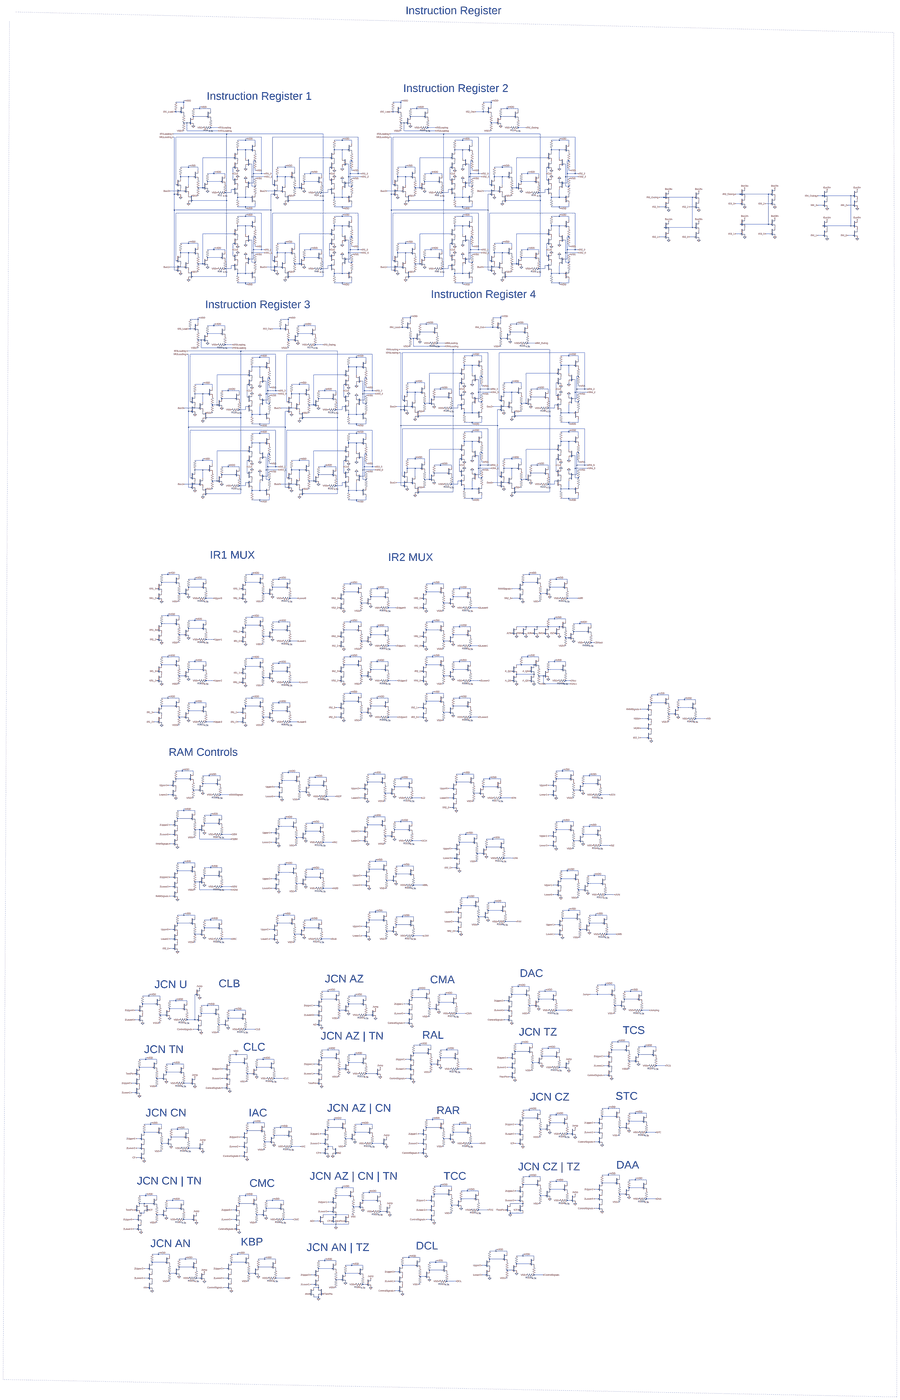
[diagram p0: schematic instruction_register.asc, whole sheet]
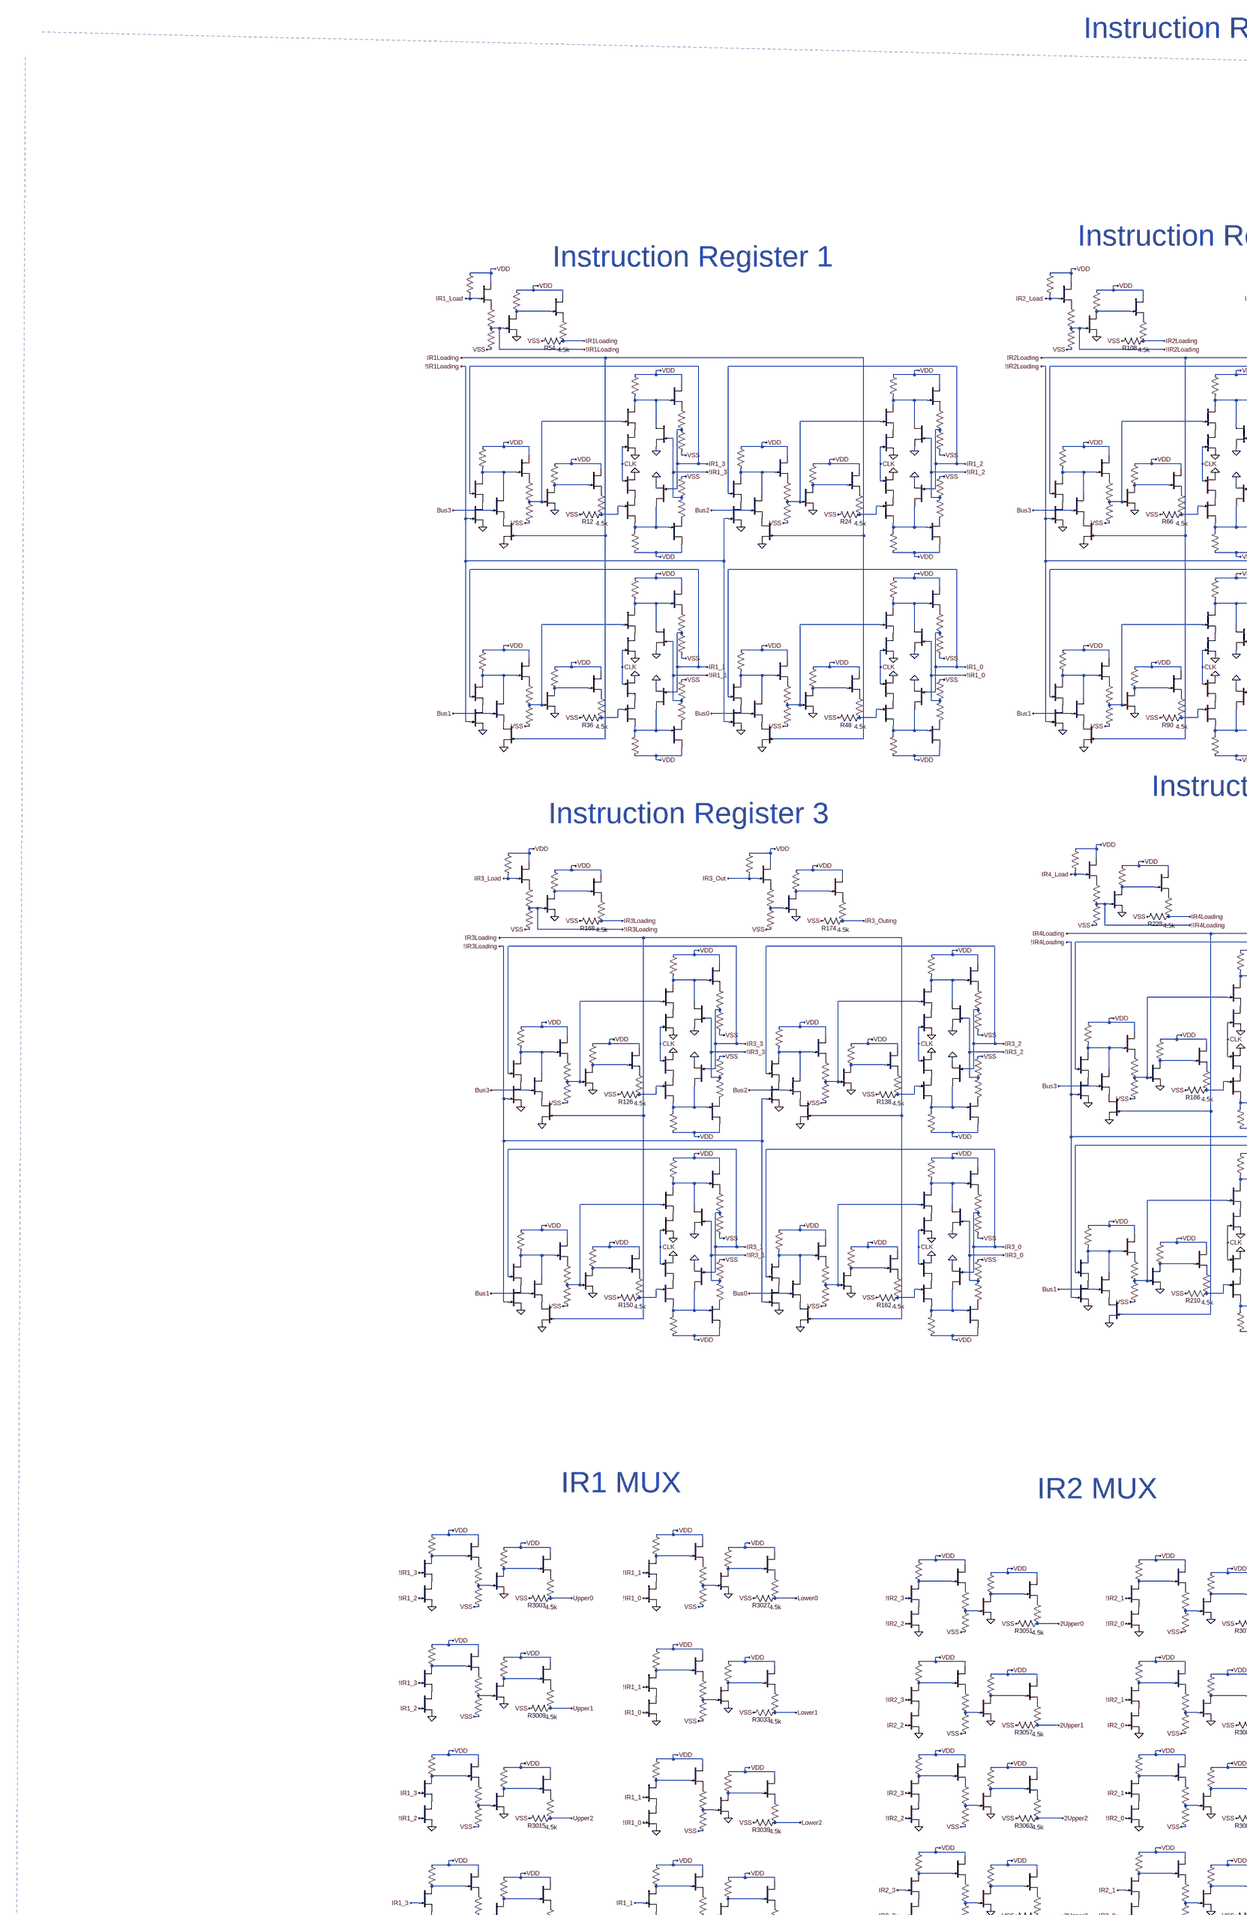
[diagram p1: schematic instruction_register.asc, part, row 1 of 2, column 1 of 2]
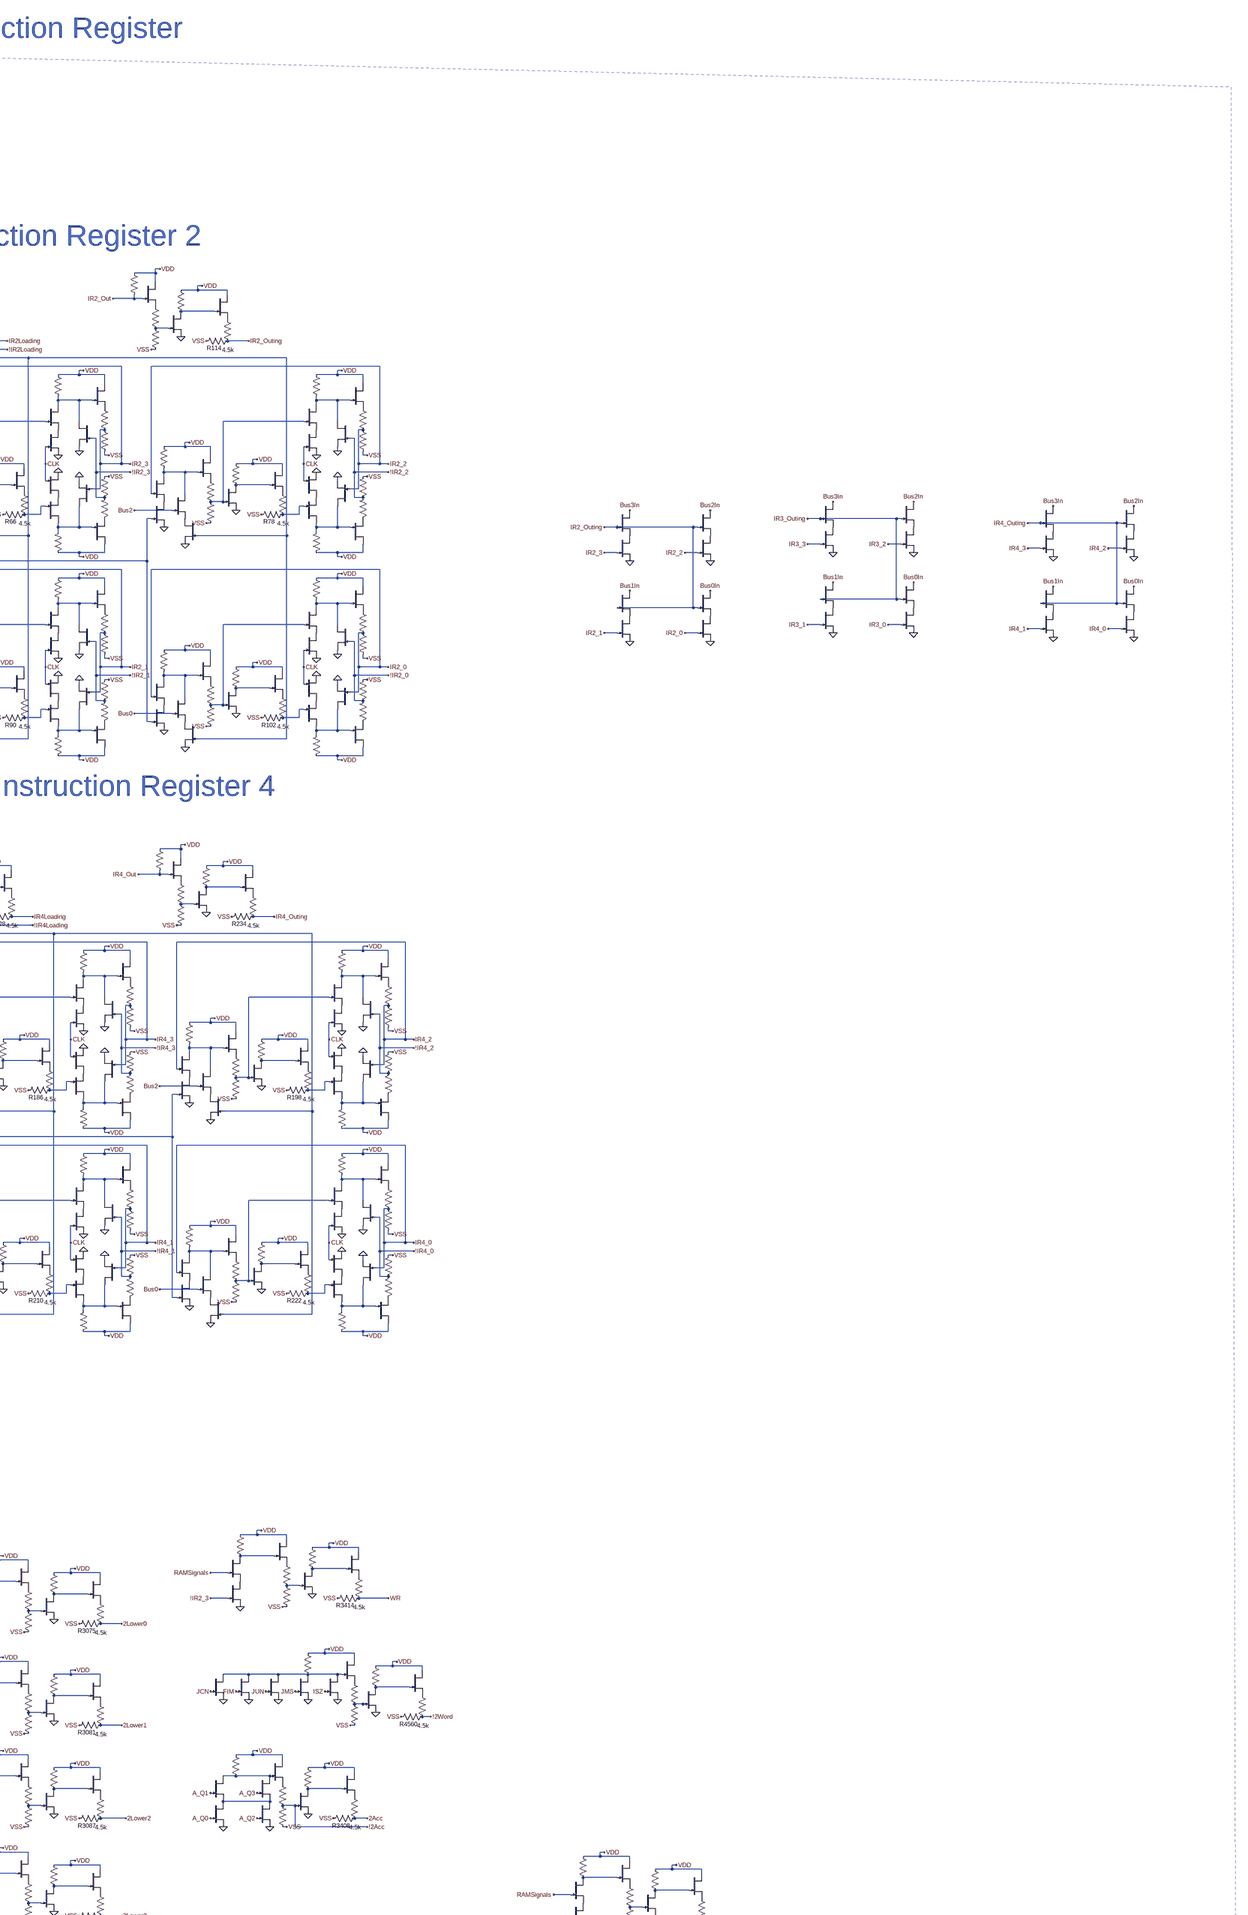
[diagram p2: schematic instruction_register.asc, part, row 1 of 2, column 2 of 2]
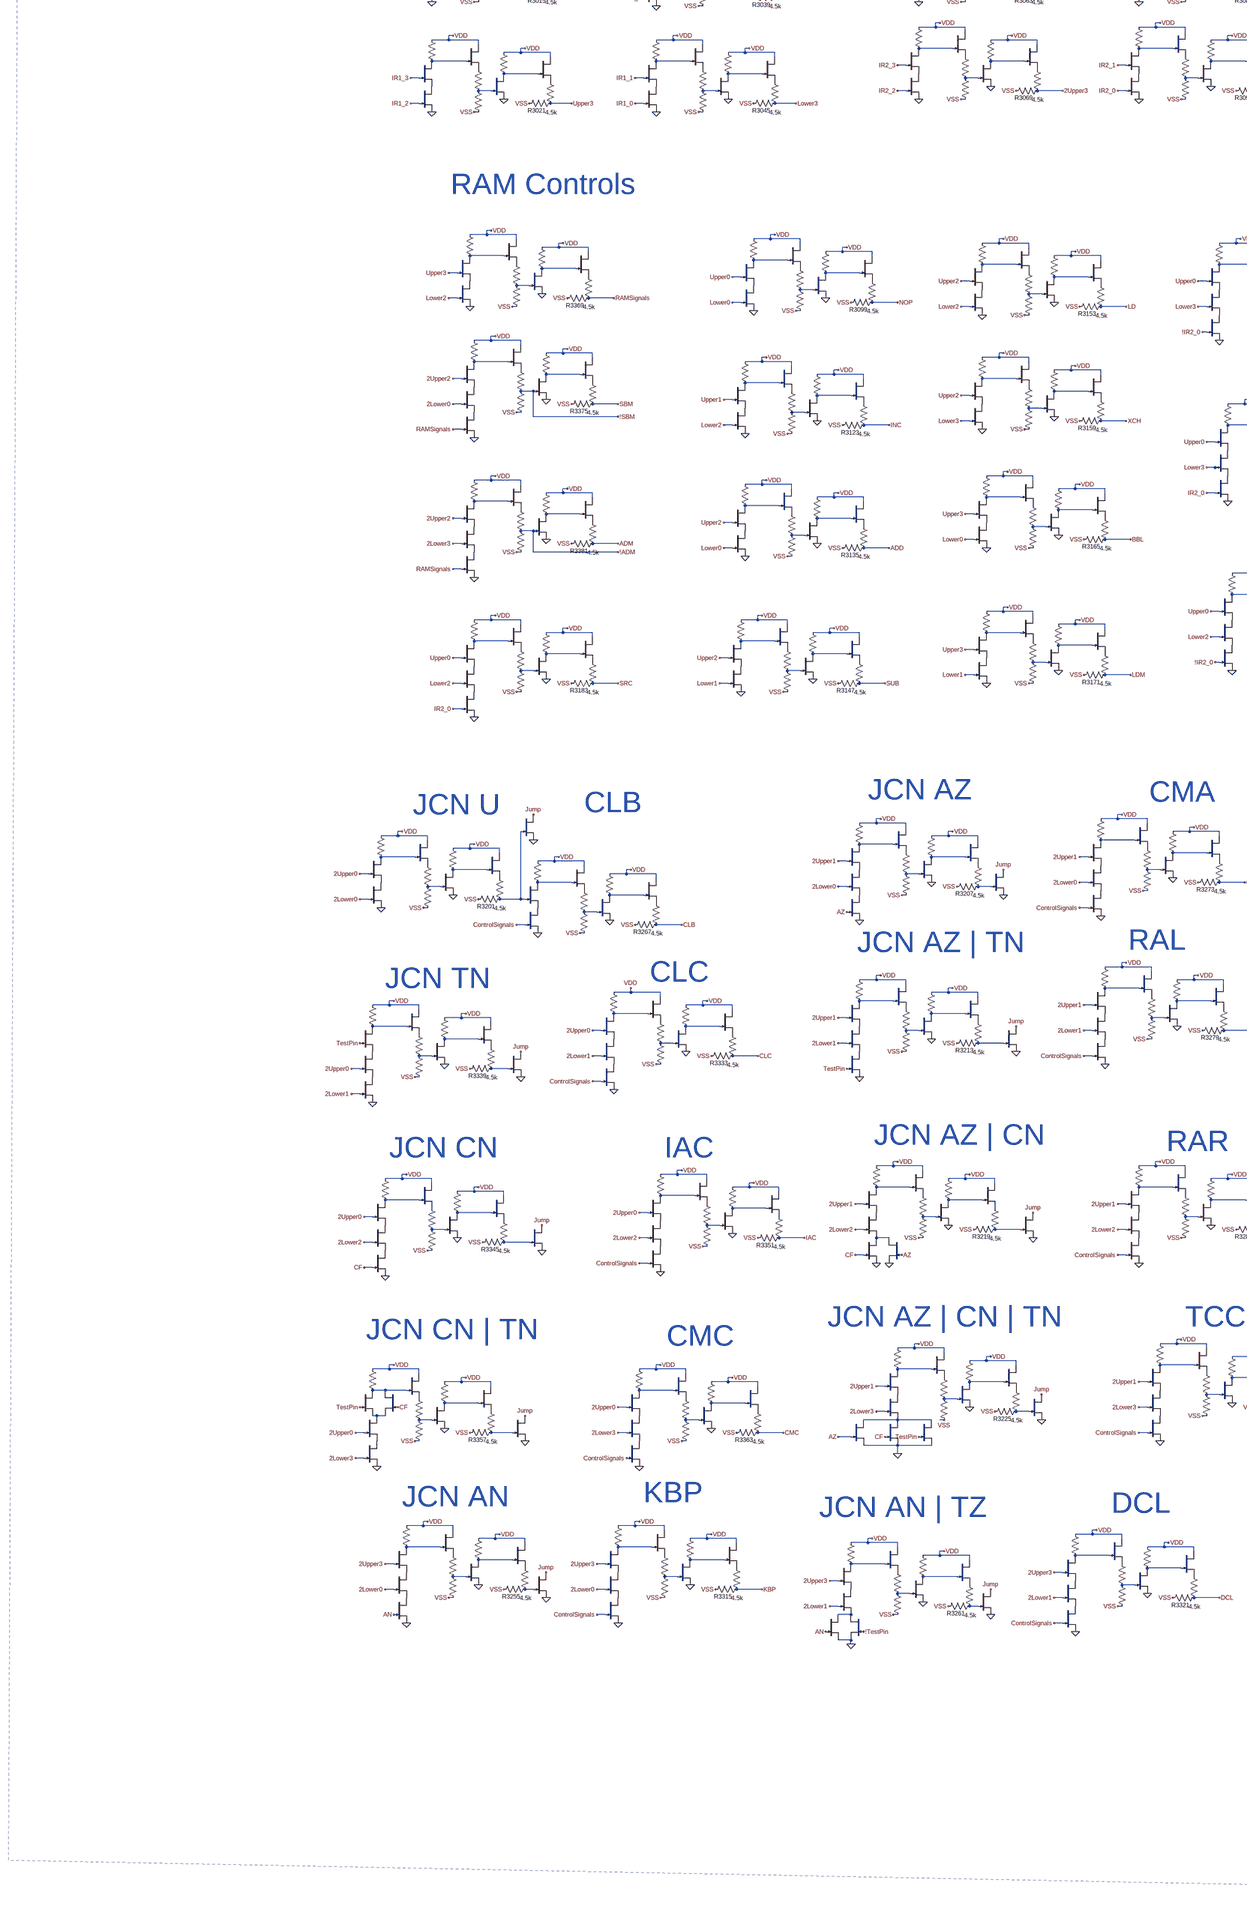
[diagram p3: schematic instruction_register.asc, part, row 2 of 2, column 1 of 2]
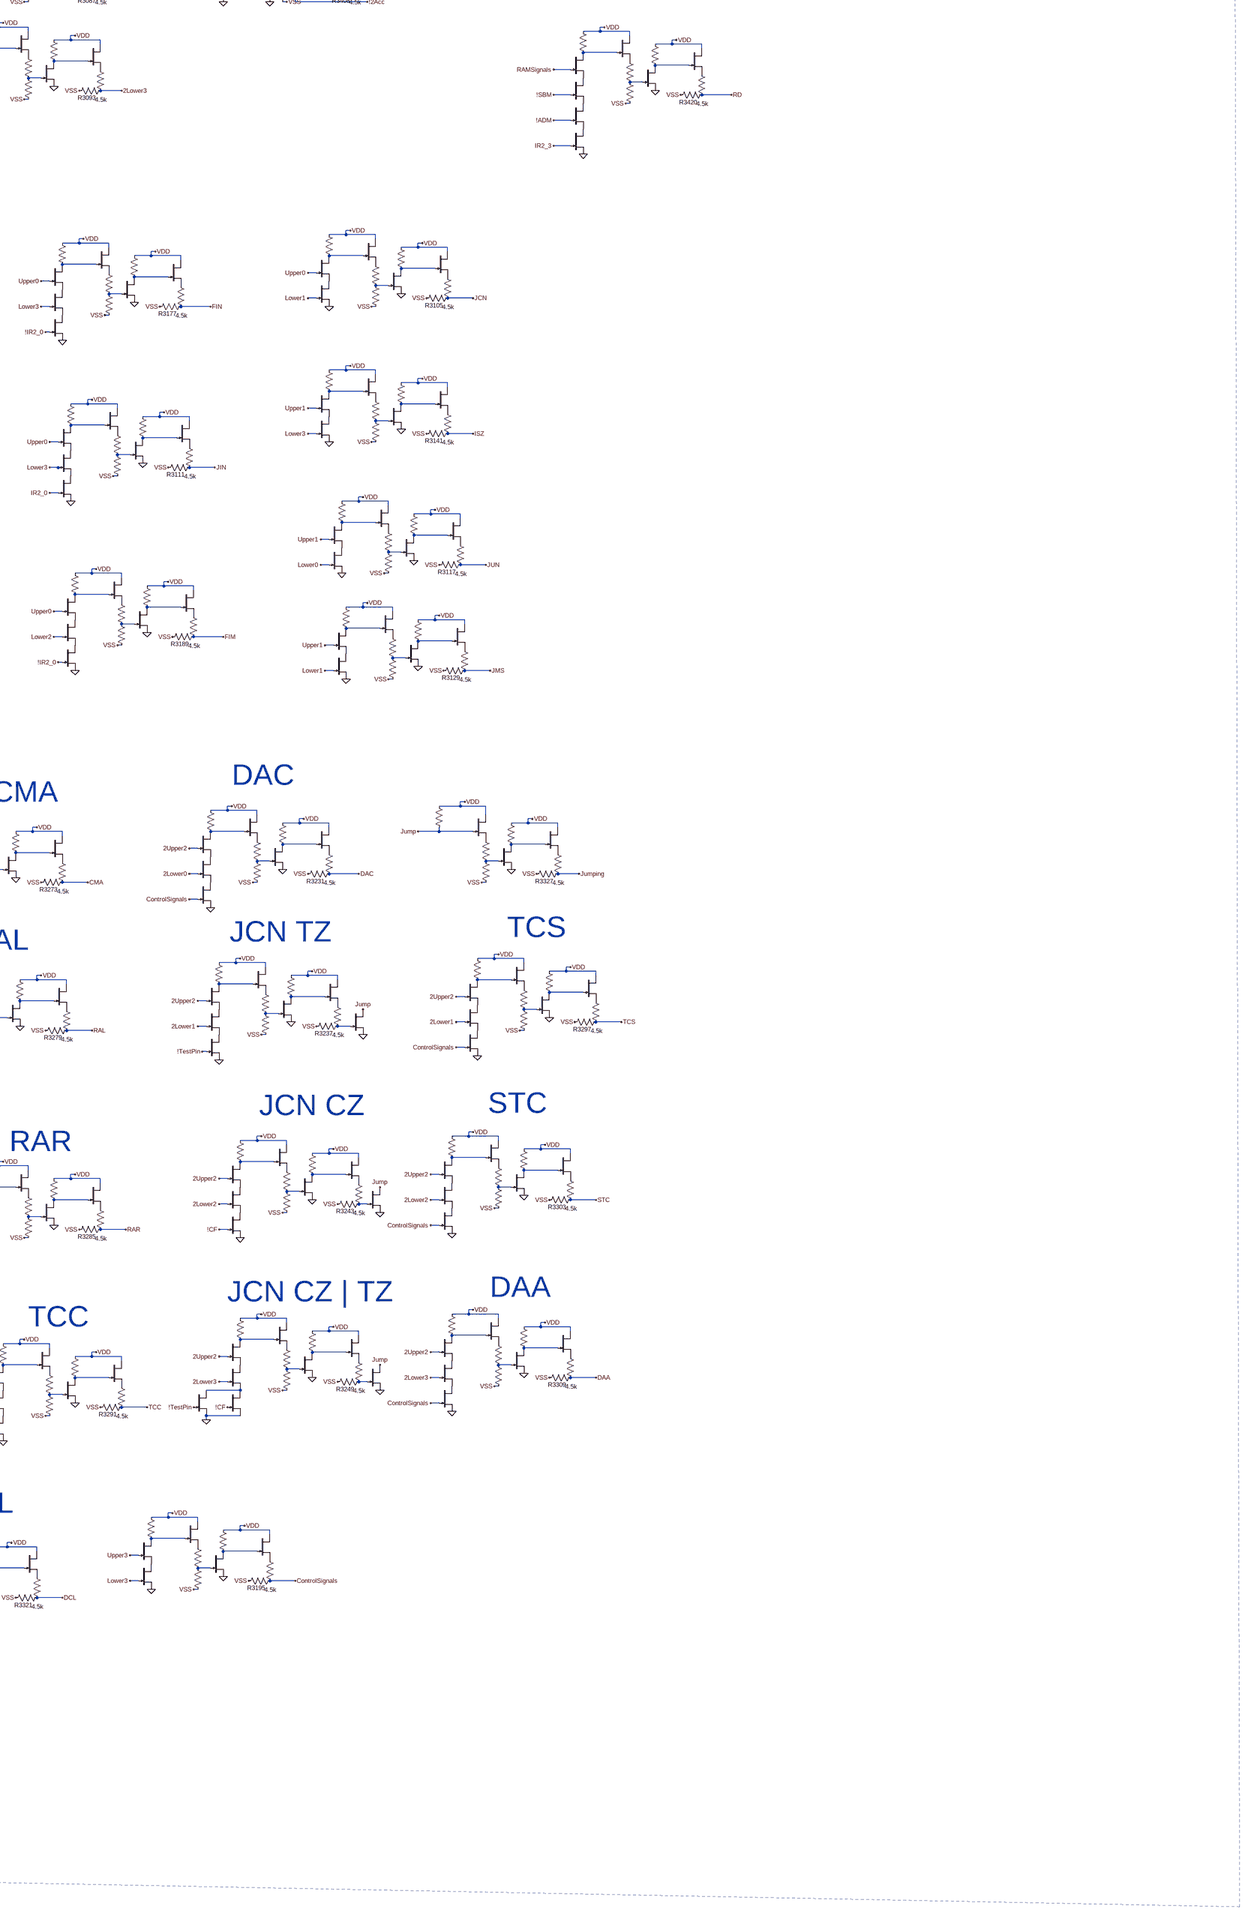
[diagram p4: schematic instruction_register.asc, part, row 2 of 2, column 2 of 2]
* instruction_register.asc
J_A1 P001 IR2_3 0 DR
J_A2 Bus3In IR2_Outing P001 DR
J_A3 P002 IR2_2 0 DR
J_A4 Bus2In IR2_Outing P002 DR
J_A5 P003 IR2_1 0 DR
J_A6 Bus1In IR2_Outing P003 DR
J_A7 P004 IR2_0 0 DR
J_A8 Bus0In IR2_Outing P004 DR
J_A9 P005 IR3_3 0 DR
J_A10 Bus3In IR3_Outing P005 DR
J_A11 P006 IR3_2 0 DR
J_A12 Bus2In IR3_Outing P006 DR
J_A13 P007 IR3_1 0 DR
J_A14 Bus1In IR3_Outing P007 DR
J_A15 P008 IR3_0 0 DR
J_A16 Bus0In IR3_Outing P008 DR
J_A17 P009 IR4_3 0 DR
J_A18 Bus3In IR4_Outing P009 DR
J_A19 P010 IR4_2 0 DR
J_A20 Bus2In IR4_Outing P010 DR
J_A21 P011 IR4_1 0 DR
J_A22 Bus1In IR4_Outing P011 DR
J_A23 P012 IR4_0 0 DR
J_A24 Bus0In IR4_Outing P012 DR
J_A25 N005 N009 P013 DR
R1 VDD N005 100k
J_F1 VDD N005 P014 DR
R2 P014 IR1_3 1k
R3 IR1_3 VSS 4.8k
J_B1 N005 !IR1_3 0 DR
J_A26 N025 N021 P015 DR
R4 VDD N025 100k
J_F2 VDD N025 P016 DR
R5 P016 !IR1_3 1k
R6 !IR1_3 VSS 4.8k
J_B2 N025 IR1_3 0 DR
J_A27 P013 CLK 0 DR
J_A28 P015 CLK 0 DR
J_A29 N013 IR1_3 P017 DR
R7 VDD N013 100k
J_F3 VDD N013 P018 DR
R8 P018 N009 1k
R9 N009 VSS 4.8k
J_B3 N013 Bus3 P019 DR
J_A30 N017 N009 0 DR
R10 VDD N017 50k
J_A31 VDD N017 P020 DR
R11 P020 N021 1k
R12 N021 VSS 4.5k
J_A32 P017 !IR1Loading 0 DR
J_B4 P019 IR1Loading 0 DR
J_A33 N006 N010 P021 DR
R13 VDD N006 100k
J_F4 VDD N006 P022 DR
R14 P022 IR1_2 1k
R15 IR1_2 VSS 4.8k
J_B5 N006 !IR1_2 0 DR
J_A34 N026 N022 P023 DR
R16 VDD N026 100k
J_F5 VDD N026 P024 DR
R17 P024 !IR1_2 1k
R18 !IR1_2 VSS 4.8k
J_B6 N026 IR1_2 0 DR
J_A35 P021 CLK 0 DR
J_A36 P023 CLK 0 DR
J_A37 N014 IR1_2 P025 DR
R19 VDD N014 100k
J_F6 VDD N014 P026 DR
R20 P026 N010 1k
R21 N010 VSS 4.8k
J_B7 N014 Bus2 P027 DR
J_A38 N018 N010 0 DR
R22 VDD N018 50k
J_A39 VDD N018 P028 DR
R23 P028 N022 1k
R24 N022 VSS 4.5k
J_A40 P025 !IR1Loading 0 DR
J_B8 P027 IR1Loading 0 DR
J_A41 N029 N033 P029 DR
R25 VDD N029 100k
J_F7 VDD N029 P030 DR
R26 P030 IR1_1 1k
R27 IR1_1 VSS 4.8k
J_B9 N029 !IR1_1 0 DR
J_A42 N049 N045 P031 DR
R28 VDD N049 100k
J_F8 VDD N049 P032 DR
R29 P032 !IR1_1 1k
R30 !IR1_1 VSS 4.8k
J_B10 N049 IR1_1 0 DR
J_A43 P029 CLK 0 DR
J_A44 P031 CLK 0 DR
J_A45 N037 IR1_1 P033 DR
R31 VDD N037 100k
J_F9 VDD N037 P034 DR
R32 P034 N033 1k
R33 N033 VSS 4.8k
J_B11 N037 Bus1 P035 DR
J_A46 N041 N033 0 DR
R34 VDD N041 50k
J_A47 VDD N041 P036 DR
R35 P036 N045 1k
R36 N045 VSS 4.5k
J_A48 P033 !IR1Loading 0 DR
J_B12 P035 IR1Loading 0 DR
J_A49 N030 N034 P037 DR
R37 VDD N030 100k
J_F10 VDD N030 P038 DR
R38 P038 IR1_0 1k
R39 IR1_0 VSS 4.8k
J_B13 N030 !IR1_0 0 DR
J_A50 N050 N046 P039 DR
R40 VDD N050 100k
J_F11 VDD N050 P040 DR
R41 P040 !IR1_0 1k
R42 !IR1_0 VSS 4.8k
J_B14 N050 IR1_0 0 DR
J_A51 P037 CLK 0 DR
J_A52 P039 CLK 0 DR
J_A53 N038 IR1_0 P041 DR
R43 VDD N038 100k
J_F12 VDD N038 P042 DR
R44 P042 N034 1k
R45 N034 VSS 4.8k
J_B15 N038 Bus0 P043 DR
J_A54 N042 N034 0 DR
R46 VDD N042 50k
J_A55 VDD N042 P044 DR
R47 P044 N046 1k
R48 N046 VSS 4.5k
J_A56 P041 !IR1Loading 0 DR
J_B16 P043 IR1Loading 0 DR
R49 VDD IR1_Load 100k
J_F13 VDD IR1_Load P045 DR
R50 P045 !IR1Loading 1k
R51 !IR1Loading VSS 4.8k
J_A57 N001 !IR1Loading 0 DR
R52 VDD N001 50k
J_A58 VDD N001 P046 DR
R53 P046 IR1Loading 1k
R54 IR1Loading VSS 4.5k
J_A59 N007 N011 P047 DR
R55 VDD N007 100k
J_F14 VDD N007 P048 DR
R56 P048 IR2_3 1k
R57 IR2_3 VSS 4.8k
J_B17 N007 !IR2_3 0 DR
J_A60 N027 N023 P049 DR
R58 VDD N027 100k
J_F15 VDD N027 P050 DR
R59 P050 !IR2_3 1k
R60 !IR2_3 VSS 4.8k
J_B18 N027 IR2_3 0 DR
J_A61 P047 CLK 0 DR
J_A62 P049 CLK 0 DR
J_A63 N015 IR2_3 P051 DR
R61 VDD N015 100k
J_F16 VDD N015 P052 DR
R62 P052 N011 1k
R63 N011 VSS 4.8k
J_B19 N015 Bus3 P053 DR
J_A64 N019 N011 0 DR
R64 VDD N019 50k
J_A65 VDD N019 P054 DR
R65 P054 N023 1k
R66 N023 VSS 4.5k
J_A66 P051 !IR2Loading 0 DR
J_B20 P053 IR2Loading 0 DR
J_A67 N008 N012 P055 DR
R67 VDD N008 100k
J_F17 VDD N008 P056 DR
R68 P056 IR2_2 1k
R69 IR2_2 VSS 4.8k
J_B21 N008 !IR2_2 0 DR
J_A68 N028 N024 P057 DR
R70 VDD N028 100k
J_F18 VDD N028 P058 DR
R71 P058 !IR2_2 1k
R72 !IR2_2 VSS 4.8k
J_B22 N028 IR2_2 0 DR
J_A69 P055 CLK 0 DR
J_A70 P057 CLK 0 DR
J_A71 N016 IR2_2 P059 DR
R73 VDD N016 100k
J_F19 VDD N016 P060 DR
R74 P060 N012 1k
R75 N012 VSS 4.8k
J_B23 N016 Bus2 P061 DR
J_A72 N020 N012 0 DR
R76 VDD N020 50k
J_A73 VDD N020 P062 DR
R77 P062 N024 1k
R78 N024 VSS 4.5k
J_A74 P059 !IR2Loading 0 DR
J_B24 P061 IR2Loading 0 DR
J_A75 N031 N035 P063 DR
R79 VDD N031 100k
J_F20 VDD N031 P064 DR
R80 P064 IR2_1 1k
R81 IR2_1 VSS 4.8k
J_B25 N031 !IR2_1 0 DR
J_A76 N051 N047 P065 DR
R82 VDD N051 100k
J_F21 VDD N051 P066 DR
R83 P066 !IR2_1 1k
R84 !IR2_1 VSS 4.8k
J_B26 N051 IR2_1 0 DR
J_A77 P063 CLK 0 DR
J_A78 P065 CLK 0 DR
J_A79 N039 IR2_1 P067 DR
R85 VDD N039 100k
J_F22 VDD N039 P068 DR
R86 P068 N035 1k
R87 N035 VSS 4.8k
J_B27 N039 Bus1 P069 DR
J_A80 N043 N035 0 DR
R88 VDD N043 50k
J_A81 VDD N043 P070 DR
R89 P070 N047 1k
R90 N047 VSS 4.5k
J_A82 P067 !IR2Loading 0 DR
J_B28 P069 IR2Loading 0 DR
J_A83 N032 N036 P071 DR
R91 VDD N032 100k
J_F23 VDD N032 P072 DR
R92 P072 IR2_0 1k
R93 IR2_0 VSS 4.8k
J_B29 N032 !IR2_0 0 DR
J_A84 N052 N048 P073 DR
R94 VDD N052 100k
J_F24 VDD N052 P074 DR
R95 P074 !IR2_0 1k
R96 !IR2_0 VSS 4.8k
J_B30 N052 IR2_0 0 DR
J_A85 P071 CLK 0 DR
J_A86 P073 CLK 0 DR
J_A87 N040 IR2_0 P075 DR
R97 VDD N040 100k
J_F25 VDD N040 P076 DR
R98 P076 N036 1k
R99 N036 VSS 4.8k
J_B31 N040 Bus0 P077 DR
J_A88 N044 N036 0 DR
R100 VDD N044 50k
J_A89 VDD N044 P078 DR
R101 P078 N048 1k
R102 N048 VSS 4.5k
J_A90 P075 !IR2Loading 0 DR
J_B32 P077 IR2Loading 0 DR
R103 VDD IR2_Load 100k
J_F26 VDD IR2_Load P079 DR
R104 P079 !IR2Loading 1k
R105 !IR2Loading VSS 4.8k
J_A91 N002 !IR2Loading 0 DR
R106 VDD N002 50k
J_A92 VDD N002 P080 DR
R107 P080 IR2Loading 1k
R108 IR2Loading VSS 4.5k
R109 VDD IR2_Out 100k
J_F27 VDD IR2_Out P081 DR
R110 P081 N004 1k
R111 N004 VSS 4.8k
J_A93 N003 N004 0 DR
R112 VDD N003 50k
J_A94 VDD N003 P082 DR
R113 P082 IR2_Outing 1k
R114 IR2_Outing VSS 4.5k
J_A95 N061 N065 P083 DR
R115 VDD N061 100k
J_F28 VDD N061 P084 DR
R116 P084 IR3_3 1k
R117 IR3_3 VSS 4.8k
J_B33 N061 !IR3_3 0 DR
J_A96 N081 N077 P085 DR
R118 VDD N081 100k
J_F29 VDD N081 P086 DR
R119 P086 !IR3_3 1k
R120 !IR3_3 VSS 4.8k
J_B34 N081 IR3_3 0 DR
J_A97 P083 CLK 0 DR
J_A98 P085 CLK 0 DR
J_A99 N069 IR3_3 P087 DR
R121 VDD N069 100k
J_F30 VDD N069 P088 DR
R122 P088 N065 1k
R123 N065 VSS 4.8k
J_B35 N069 Bus3 P089 DR
J_A100 N073 N065 0 DR
R124 VDD N073 50k
J_A101 VDD N073 P090 DR
R125 P090 N077 1k
R126 N077 VSS 4.5k
J_A102 P087 !IR3Loading 0 DR
J_B36 P089 IR3Loading 0 DR
J_A103 N062 N066 P091 DR
R127 VDD N062 100k
J_F31 VDD N062 P092 DR
R128 P092 IR3_2 1k
R129 IR3_2 VSS 4.8k
J_B37 N062 !IR3_2 0 DR
J_A104 N082 N078 P093 DR
R130 VDD N082 100k
J_F32 VDD N082 P094 DR
R131 P094 !IR3_2 1k
R132 !IR3_2 VSS 4.8k
J_B38 N082 IR3_2 0 DR
J_A105 P091 CLK 0 DR
J_A106 P093 CLK 0 DR
J_A107 N070 IR3_2 P095 DR
R133 VDD N070 100k
J_F33 VDD N070 P096 DR
R134 P096 N066 1k
R135 N066 VSS 4.8k
J_B39 N070 Bus2 P097 DR
J_A108 N074 N066 0 DR
R136 VDD N074 50k
J_A109 VDD N074 P098 DR
R137 P098 N078 1k
R138 N078 VSS 4.5k
J_A110 P095 !IR3Loading 0 DR
J_B40 P097 IR3Loading 0 DR
J_A111 N085 N089 P099 DR
R139 VDD N085 100k
J_F34 VDD N085 P100 DR
R140 P100 IR3_1 1k
R141 IR3_1 VSS 4.8k
J_B41 N085 !IR3_1 0 DR
J_A112 N105 N101 P101 DR
R142 VDD N105 100k
J_F35 VDD N105 P102 DR
R143 P102 !IR3_1 1k
R144 !IR3_1 VSS 4.8k
J_B42 N105 IR3_1 0 DR
J_A113 P099 CLK 0 DR
J_A114 P101 CLK 0 DR
J_A115 N093 IR3_1 P103 DR
R145 VDD N093 100k
J_F36 VDD N093 P104 DR
R146 P104 N089 1k
R147 N089 VSS 4.8k
J_B43 N093 Bus1 P105 DR
J_A116 N097 N089 0 DR
R148 VDD N097 50k
J_A117 VDD N097 P106 DR
R149 P106 N101 1k
R150 N101 VSS 4.5k
J_A118 P103 !IR3Loading 0 DR
J_B44 P105 IR3Loading 0 DR
J_A119 N086 N090 P107 DR
R151 VDD N086 100k
J_F37 VDD N086 P108 DR
R152 P108 IR3_0 1k
R153 IR3_0 VSS 4.8k
J_B45 N086 !IR3_0 0 DR
J_A120 N106 N102 P109 DR
R154 VDD N106 100k
J_F38 VDD N106 P110 DR
R155 P110 !IR3_0 1k
R156 !IR3_0 VSS 4.8k
J_B46 N106 IR3_0 0 DR
J_A121 P107 CLK 0 DR
J_A122 P109 CLK 0 DR
J_A123 N094 IR3_0 P111 DR
R157 VDD N094 100k
J_F39 VDD N094 P112 DR
R158 P112 N090 1k
R159 N090 VSS 4.8k
J_B47 N094 Bus0 P113 DR
J_A124 N098 N090 0 DR
R160 VDD N098 50k
J_A125 VDD N098 P114 DR
R161 P114 N102 1k
R162 N102 VSS 4.5k
J_A126 P111 !IR3Loading 0 DR
J_B48 P113 IR3Loading 0 DR
R163 VDD IR3_Load 100k
J_F40 VDD IR3_Load P115 DR
R164 P115 !IR3Loading 1k
R165 !IR3Loading VSS 4.8k
J_A127 N055 !IR3Loading 0 DR
R166 VDD N055 50k
J_A128 VDD N055 P116 DR
R167 P116 IR3Loading 1k
R168 IR3Loading VSS 4.5k
R169 VDD IR3_Out 100k
J_F41 VDD IR3_Out P117 DR
R170 P117 N058 1k
R171 N058 VSS 4.8k
J_A129 N056 N058 0 DR
R172 VDD N056 50k
J_A130 VDD N056 P118 DR
R173 P118 IR3_Outing 1k
R174 IR3_Outing VSS 4.5k
J_A131 N059 N063 P119 DR
R175 VDD N059 100k
J_F42 VDD N059 P120 DR
R176 P120 IR4_3 1k
R177 IR4_3 VSS 4.8k
J_B49 N059 !IR4_3 0 DR
J_A132 N079 N075 P121 DR
R178 VDD N079 100k
J_F43 VDD N079 P122 DR
R179 P122 !IR4_3 1k
R180 !IR4_3 VSS 4.8k
J_B50 N079 IR4_3 0 DR
J_A133 P119 CLK 0 DR
J_A134 P121 CLK 0 DR
J_A135 N067 IR4_3 P123 DR
R181 VDD N067 100k
J_F44 VDD N067 P124 DR
R182 P124 N063 1k
R183 N063 VSS 4.8k
J_B51 N067 Bus3 P125 DR
J_A136 N071 N063 0 DR
R184 VDD N071 50k
J_A137 VDD N071 P126 DR
R185 P126 N075 1k
R186 N075 VSS 4.5k
J_A138 P123 !IR4Loading 0 DR
J_B52 P125 IR4Loading 0 DR
J_A139 N060 N064 P127 DR
R187 VDD N060 100k
J_F45 VDD N060 P128 DR
R188 P128 IR4_2 1k
R189 IR4_2 VSS 4.8k
J_B53 N060 !IR4_2 0 DR
J_A140 N080 N076 P129 DR
R190 VDD N080 100k
J_F46 VDD N080 P130 DR
R191 P130 !IR4_2 1k
R192 !IR4_2 VSS 4.8k
J_B54 N080 IR4_2 0 DR
J_A141 P127 CLK 0 DR
J_A142 P129 CLK 0 DR
J_A143 N068 IR4_2 P131 DR
R193 VDD N068 100k
J_F47 VDD N068 P132 DR
R194 P132 N064 1k
R195 N064 VSS 4.8k
J_B55 N068 Bus2 P133 DR
J_A144 N072 N064 0 DR
R196 VDD N072 50k
J_A145 VDD N072 P134 DR
R197 P134 N076 1k
R198 N076 VSS 4.5k
J_A146 P131 !IR4Loading 0 DR
J_B56 P133 IR4Loading 0 DR
J_A147 N083 N087 P135 DR
R199 VDD N083 100k
J_F48 VDD N083 P136 DR
R200 P136 IR4_1 1k
R201 IR4_1 VSS 4.8k
J_B57 N083 !IR4_1 0 DR
J_A148 N103 N099 P137 DR
R202 VDD N103 100k
J_F49 VDD N103 P138 DR
R203 P138 !IR4_1 1k
R204 !IR4_1 VSS 4.8k
J_B58 N103 IR4_1 0 DR
J_A149 P135 CLK 0 DR
J_A150 P137 CLK 0 DR
J_A151 N091 IR4_1 P139 DR
R205 VDD N091 100k
J_F50 VDD N091 P140 DR
R206 P140 N087 1k
R207 N087 VSS 4.8k
J_B59 N091 Bus1 P141 DR
J_A152 N095 N087 0 DR
R208 VDD N095 50k
J_A153 VDD N095 P142 DR
R209 P142 N099 1k
R210 N099 VSS 4.5k
J_A154 P139 !IR4Loading 0 DR
J_B60 P141 IR4Loading 0 DR
J_A155 N084 N088 P143 DR
R211 VDD N084 100k
J_F51 VDD N084 P144 DR
R212 P144 IR4_0 1k
R213 IR4_0 VSS 4.8k
J_B61 N084 !IR4_0 0 DR
J_A156 N104 N100 P145 DR
R214 VDD N104 100k
J_F52 VDD N104 P146 DR
R215 P146 !IR4_0 1k
R216 !IR4_0 VSS 4.8k
J_B62 N104 IR4_0 0 DR
J_A157 P143 CLK 0 DR
J_A158 P145 CLK 0 DR
J_A159 N092 IR4_0 P147 DR
R217 VDD N092 100k
J_F53 VDD N092 P148 DR
R218 P148 N088 1k
R219 N088 VSS 4.8k
J_B63 N092 Bus0 P149 DR
J_A160 N096 N088 0 DR
R220 VDD N096 50k
J_A161 VDD N096 P150 DR
R221 P150 N100 1k
R222 N100 VSS 4.5k
J_A162 P147 !IR4Loading 0 DR
J_B64 P149 IR4Loading 0 DR
R223 VDD IR4_Load 100k
J_F54 VDD IR4_Load P151 DR
R224 P151 !IR4Loading 1k
R225 !IR4Loading VSS 4.8k
J_A163 N053 !IR4Loading 0 DR
R226 VDD N053 50k
J_A164 VDD N053 P152 DR
R227 P152 IR4Loading 1k
R228 IR4Loading VSS 4.5k
R229 VDD IR4_Out 100k
J_F55 VDD IR4_Out P153 DR
R230 P153 N057 1k
R231 N057 VSS 4.8k
J_A165 N054 N057 0 DR
R232 VDD N054 50k
J_A166 VDD N054 P154 DR
R233 P154 IR4_Outing 1k
R234 IR4_Outing VSS 4.5k
J_A1920 N107 !IR1_3 P155 DR
R2998 VDD N107 100k
J_F734 VDD N107 P156 DR
R2999 P156 N115 1k
R3000 N115 VSS 4.8k
J_B906 P155 !IR1_2 0 DR
J_A1921 N110 N115 0 DR
R3001 VDD N110 50k
J_F735 VDD N110 P157 DR
R3002 P157 Upper0 1k
R3003 Upper0 VSS 4.5k
J_A1922 N122 !IR1_3 P158 DR
R3004 VDD N122 100k
J_F736 VDD N122 P159 DR
R3005 P159 N130 1k
R3006 N130 VSS 4.8k
J_B907 P158 IR1_2 0 DR
J_A1923 N125 N130 0 DR
R3007 VDD N125 50k
J_F737 VDD N125 P160 DR
R3008 P160 Upper1 1k
R3009 Upper1 VSS 4.5k
J_A1924 N137 IR1_3 P161 DR
R3010 VDD N137 100k
J_F738 VDD N137 P162 DR
R3011 P162 N148 1k
R3012 N148 VSS 4.8k
J_B908 P161 !IR1_2 0 DR
J_A1925 N142 N148 0 DR
R3013 VDD N142 50k
J_F739 VDD N142 P163 DR
R3014 P163 Upper2 1k
R3015 Upper2 VSS 4.5k
J_A1926 N155 IR1_3 P164 DR
R3016 VDD N155 100k
J_F740 VDD N155 P165 DR
R3017 P165 N165 1k
R3018 N165 VSS 4.8k
J_B909 P164 IR1_2 0 DR
J_A1927 N160 N165 0 DR
R3019 VDD N160 50k
J_F741 VDD N160 P166 DR
R3020 P166 Upper3 1k
R3021 Upper3 VSS 4.5k
J_A1928 N108 !IR1_1 P167 DR
R3022 VDD N108 100k
J_F742 VDD N108 P168 DR
R3023 P168 N116 1k
R3024 N116 VSS 4.8k
J_B910 P167 !IR1_0 0 DR
J_A1929 N111 N116 0 DR
R3025 VDD N111 50k
J_F743 VDD N111 P169 DR
R3026 P169 Lower0 1k
R3027 Lower0 VSS 4.5k
J_A1930 N123 !IR1_1 P170 DR
R3028 VDD N123 100k
J_F744 VDD N123 P171 DR
R3029 P171 N133 1k
R3030 N133 VSS 4.8k
J_B911 P170 IR1_0 0 DR
J_A1931 N126 N133 0 DR
R3031 VDD N126 50k
J_F745 VDD N126 P172 DR
R3032 P172 Lower1 1k
R3033 Lower1 VSS 4.5k
J_A1932 N141 IR1_1 P173 DR
R3034 VDD N141 100k
J_F746 VDD N141 P174 DR
R3035 P174 N151 1k
R3036 N151 VSS 4.8k
J_B912 P173 !IR1_0 0 DR
J_A1933 N146 N151 0 DR
R3037 VDD N146 50k
J_F747 VDD N146 P175 DR
R3038 P175 Lower2 1k
R3039 Lower2 VSS 4.5k
J_A1934 N156 IR1_1 P176 DR
R3040 VDD N156 100k
J_F748 VDD N156 P177 DR
R3041 P177 N166 1k
R3042 N166 VSS 4.8k
J_B913 P176 IR1_0 0 DR
J_A1935 N161 N166 0 DR
R3043 VDD N161 50k
J_F749 VDD N161 P178 DR
R3044 P178 Lower3 1k
R3045 Lower3 VSS 4.5k
J_A1936 N113 !IR2_3 P179 DR
R3046 VDD N113 100k
J_F750 VDD N113 P180 DR
R3047 P180 N120 1k
R3048 N120 VSS 4.8k
J_B914 P179 !IR2_2 0 DR
J_A1937 N118 N120 0 DR
R3049 VDD N118 50k
J_F751 VDD N118 P181 DR
R3050 P181 2Upper0 1k
R3051 2Upper0 VSS 4.5k
J_A1938 N127 !IR2_3 P182 DR
R3052 VDD N127 100k
J_F752 VDD N127 P183 DR
R3053 P183 N135 1k
R3054 N135 VSS 4.8k
J_B915 P182 IR2_2 0 DR
J_A1939 N131 N135 0 DR
R3055 VDD N131 50k
J_F753 VDD N131 P184 DR
R3056 P184 2Upper1 1k
R3057 2Upper1 VSS 4.5k
J_A1940 N138 IR2_3 P185 DR
R3058 VDD N138 100k
J_F754 VDD N138 P186 DR
R3059 P186 N149 1k
R3060 N149 VSS 4.8k
J_B916 P185 !IR2_2 0 DR
J_A1941 N143 N149 0 DR
R3061 VDD N143 50k
J_F755 VDD N143 P187 DR
R3062 P187 2Upper2 1k
R3063 2Upper2 VSS 4.5k
J_A1942 N152 IR2_3 P188 DR
R3064 VDD N152 100k
J_F756 VDD N152 P189 DR
R3065 P189 N162 1k
R3066 N162 VSS 4.8k
J_B917 P188 IR2_2 0 DR
J_A1943 N157 N162 0 DR
R3067 VDD N157 50k
J_F757 VDD N157 P190 DR
R3068 P190 2Upper3 1k
R3069 2Upper3 VSS 4.5k
J_A1944 N114 !IR2_1 P191 DR
R3070 VDD N114 100k
J_F758 VDD N114 P192 DR
R3071 P192 N121 1k
R3072 N121 VSS 4.8k
J_B918 P191 !IR2_0 0 DR
J_A1945 N119 N121 0 DR
R3073 VDD N119 50k
J_F759 VDD N119 P193 DR
R3074 P193 2Lower0 1k
R3075 2Lower0 VSS 4.5k
J_A1946 N128 !IR2_1 P194 DR
R3076 VDD N128 100k
J_F760 VDD N128 P195 DR
R3077 P195 N136 1k
R3078 N136 VSS 4.8k
J_B919 P194 IR2_0 0 DR
J_A1947 N132 N136 0 DR
R3079 VDD N132 50k
J_F761 VDD N132 P196 DR
R3080 P196 2Lower1 1k
R3081 2Lower1 VSS 4.5k
J_A1948 N139 IR2_1 P197 DR
R3082 VDD N139 100k
J_F762 VDD N139 P198 DR
R3083 P198 N150 1k
R3084 N150 VSS 4.8k
J_B920 P197 !IR2_0 0 DR
J_A1949 N144 N150 0 DR
R3085 VDD N144 50k
J_F763 VDD N144 P199 DR
R3086 P199 2Lower2 1k
R3087 2Lower2 VSS 4.5k
J_A1950 N153 IR2_1 P200 DR
R3088 VDD N153 100k
J_F764 VDD N153 P201 DR
R3089 P201 N163 1k
R3090 N163 VSS 4.8k
J_B921 P200 IR2_0 0 DR
J_A1951 N158 N163 0 DR
R3091 VDD N158 50k
J_F765 VDD N158 P202 DR
R3092 P202 2Lower3 1k
R3093 2Lower3 VSS 4.5k
J_A1952 N169 Upper0 P203 DR
R3094 VDD N169 100k
J_F766 VDD N169 P204 DR
R3095 P204 N179 1k
R3096 N179 VSS 4.8k
J_B922 P203 Lower0 0 DR
J_A1953 N174 N179 0 DR
R3097 VDD N174 50k
J_F767 VDD N174 P205 DR
R3098 P205 NOP 1k
R3099 NOP VSS 4.5k
J_A1954 N168 Upper0 P206 DR
R3100 VDD N168 100k
J_F768 VDD N168 P207 DR
R3101 P207 N178 1k
R3102 N178 VSS 4.8k
J_B923 P206 Lower1 0 DR
J_A1955 N173 N178 0 DR
R3103 VDD N173 50k
J_F769 VDD N173 P208 DR
R3104 P208 JCN 1k
R3105 JCN VSS 4.5k
J_A1956 N193 Upper0 P209 DR
R3106 VDD N193 100k
J_F770 VDD N193 P210 DR
R3107 P210 N195 1k
R3108 N195 VSS 4.8k
J_B924 P209 Lower3 P211 DR
J_A1957 N194 N195 0 DR
R3109 VDD N194 50k
J_F771 VDD N194 P212 DR
R3110 P212 JIN 1k
R3111 JIN VSS 4.5k
J_A1958 N202 Upper1 P213 DR
R3112 VDD N202 100k
J_F772 VDD N202 P214 DR
R3113 P214 N206 1k
R3114 N206 VSS 4.8k
J_B925 P213 Lower0 0 DR
J_A1959 N205 N206 0 DR
R3115 VDD N205 50k
J_F773 VDD N205 P215 DR
R3116 P215 JUN 1k
R3117 JUN VSS 4.5k
J_A1960 N185 Upper1 P216 DR
R3118 VDD N185 100k
J_F774 VDD N185 P217 DR
R3119 P217 N191 1k
R3120 N191 VSS 4.8k
J_B926 P216 Lower2 0 DR
J_A1961 N188 N191 0 DR
R3121 VDD N188 50k
J_F775 VDD N188 P218 DR
R3122 P218 INC 1k
R3123 INC VSS 4.5k
J_A1962 N210 Upper1 P219 DR
R3124 VDD N210 100k
J_F776 VDD N210 P220 DR
R3125 P220 N218 1k
R3126 N218 VSS 4.8k
J_B927 P219 Lower1 0 DR
J_A1963 N214 N218 0 DR
R3127 VDD N214 50k
J_F777 VDD N214 P221 DR
R3128 P221 JMS 1k
R3129 JMS VSS 4.5k
J_A1964 N198 Upper2 P222 DR
R3130 VDD N198 100k
J_F778 VDD N198 P223 DR
R3131 P223 N204 1k
R3132 N204 VSS 4.8k
J_B928 P222 Lower0 0 DR
J_A1965 N201 N204 0 DR
R3133 VDD N201 50k
J_F779 VDD N201 P224 DR
R3134 P224 ADD 1k
R3135 ADD VSS 4.5k
J_A1966 N187 Upper1 P225 DR
R3136 VDD N187 100k
J_F780 VDD N187 P226 DR
R3137 P226 N192 1k
R3138 N192 VSS 4.8k
J_B929 P225 Lower3 0 DR
J_A1967 N189 N192 0 DR
R3139 VDD N189 50k
J_F781 VDD N189 P227 DR
R3140 P227 ISZ 1k
R3141 ISZ VSS 4.5k
J_A1968 N213 Upper2 P228 DR
R3142 VDD N213 100k
J_F782 VDD N213 P229 DR
R3143 P229 N221 1k
R3144 N221 VSS 4.8k
J_B930 P228 Lower1 0 DR
J_A1969 N217 N221 0 DR
R3145 VDD N217 50k
J_F783 VDD N217 P230 DR
R3146 P230 SUB 1k
R3147 SUB VSS 4.5k
J_A1970 N170 Upper2 P231 DR
R3148 VDD N170 100k
J_F784 VDD N170 P232 DR
R3149 P232 N180 1k
R3150 N180 VSS 4.8k
J_B931 P231 Lower2 0 DR
J_A1971 N175 N180 0 DR
R3151 VDD N175 50k
J_F785 VDD N175 P233 DR
R3152 P233 LD 1k
R3153 LD VSS 4.5k
J_A1972 N184 Upper2 P234 DR
R3154 VDD N184 100k
J_F786 VDD N184 P235 DR
R3155 P235 N190 1k
R3156 N190 VSS 4.8k
J_B932 P234 Lower3 0 DR
J_A1973 N186 N190 0 DR
R3157 VDD N186 50k
J_F787 VDD N186 P236 DR
R3158 P236 XCH 1k
R3159 XCH VSS 4.5k
J_A1974 N196 Upper3 P237 DR
R3160 VDD N196 100k
J_F788 VDD N196 P238 DR
R3161 P238 N203 1k
R3162 N203 VSS 4.8k
J_B933 P237 Lower0 0 DR
J_A1975 N199 N203 0 DR
R3163 VDD N199 50k
J_F789 VDD N199 P239 DR
R3164 P239 BBL 1k
R3165 BBL VSS 4.5k
J_A1976 N211 Upper3 P240 DR
R3166 VDD N211 100k
J_F790 VDD N211 P241 DR
R3167 P241 N219 1k
R3168 N219 VSS 4.8k
J_B934 P240 Lower1 0 DR
J_A1977 N215 N219 0 DR
R3169 VDD N215 50k
J_F791 VDD N215 P242 DR
R3170 P242 LDM 1k
R3171 LDM VSS 4.5k
J_B935 P211 IR2_0 0 DR
J_A1978 N171 Upper0 P243 DR
R3172 VDD N171 100k
J_F792 VDD N171 P244 DR
R3173 P244 N181 1k
R3174 N181 VSS 4.8k
J_B936 P243 Lower3 P245 DR
J_A1979 N176 N181 0 DR
R3175 VDD N176 50k
J_F793 VDD N176 P246 DR
R3176 P246 FIN 1k
R3177 FIN VSS 4.5k
J_B937 P245 !IR2_0 0 DR
J_A1980 N212 Upper0 P247 DR
R3178 VDD N212 100k
J_F794 VDD N212 P248 DR
R3179 P248 N220 1k
R3180 N220 VSS 4.8k
J_B938 P247 Lower2 P249 DR
J_A1981 N216 N220 0 DR
R3181 VDD N216 50k
J_F795 VDD N216 P250 DR
R3182 P250 SRC 1k
R3183 SRC VSS 4.5k
J_B939 P249 IR2_0 0 DR
J_A1982 N207 Upper0 P251 DR
R3184 VDD N207 100k
J_F796 VDD N207 P252 DR
R3185 P252 N209 1k
R3186 N209 VSS 4.8k
J_B940 P251 Lower2 P253 DR
J_A1983 N208 N209 0 DR
R3187 VDD N208 50k
J_F797 VDD N208 P254 DR
R3188 P254 FIM 1k
R3189 FIM VSS 4.5k
J_B941 P253 !IR2_0 0 DR
J_A1984 N308 Upper3 P255 DR
R3190 VDD N308 100k
J_F798 VDD N308 P256 DR
R3191 P256 N317 1k
R3192 N317 VSS 4.8k
J_B942 P255 Lower3 0 DR
J_A1985 N311 N317 0 DR
R3193 VDD N311 50k
J_F799 VDD N311 P257 DR
R3194 P257 ControlSignals 1k
R3195 ControlSignals VSS 4.5k
J_A1986 N228 2Upper0 P258 DR
R3196 VDD N228 100k
J_F800 VDD N228 P259 DR
R3197 P259 N236 1k
R3198 N236 VSS 4.8k
J_B943 P258 2Lower0 0 DR
J_A1987 N232 N236 0 DR
R3199 VDD N232 50k
J_F801 VDD N232 P260 DR
R3200 P260 N239 1k
R3201 N239 VSS 4.5k
J_A1988 N224 2Upper1 P261 DR
R3202 VDD N224 100k
J_F802 VDD N224 P262 DR
R3203 P262 N234 1k
R3204 N234 VSS 4.8k
J_B944 P261 2Lower0 P263 DR
J_A1989 N229 N234 0 DR
R3205 VDD N229 50k
J_F803 VDD N229 P264 DR
R3206 P264 N237 1k
R3207 N237 VSS 4.5k
J_A1990 N246 2Upper1 P265 DR
R3208 VDD N246 100k
J_F804 VDD N246 P266 DR
R3209 P266 N256 1k
R3210 N256 VSS 4.8k
J_B945 P265 2Lower1 P267 DR
J_A1991 N250 N256 0 DR
R3211 VDD N250 50k
J_F805 VDD N250 P268 DR
R3212 P268 N259 1k
R3213 N259 VSS 4.5k
J_A1992 N266 2Upper1 P269 DR
R3214 VDD N266 100k
J_F806 VDD N266 P270 DR
R3215 P270 N277 1k
R3216 N277 VSS 4.8k
J_B946 P269 2Lower2 N282 DR
J_A1993 N272 N277 0 DR
R3217 VDD N272 50k
J_F807 VDD N272 P271 DR
R3218 P271 N281 1k
R3219 N281 VSS 4.5k
J_A1994 N290 2Upper1 P272 DR
R3220 VDD N290 100k
J_F808 VDD N290 P273 DR
R3221 P273 N299 1k
R3222 N299 VSS 4.8k
J_B947 P272 2Lower3 N306 DR
J_A1995 N293 N299 0 DR
R3223 VDD N293 50k
J_F809 VDD N293 P274 DR
R3224 P274 N302 1k
R3225 N302 VSS 4.5k
J_A1996 N222 2Upper2 P275 DR
R3226 VDD N222 100k
J_F810 VDD N222 P276 DR
R3227 P276 N230 1k
R3228 N230 VSS 4.8k
J_B948 P275 2Lower0 P277 DR
J_A1997 N225 N230 0 DR
R3229 VDD N225 50k
J_F811 VDD N225 P278 DR
R3230 P278 DAC 1k
R3231 DAC VSS 4.5k
J_A1998 N242 2Upper2 P279 DR
R3232 VDD N242 100k
J_F812 VDD N242 P280 DR
R3233 P280 N251 1k
R3234 N251 VSS 4.8k
J_B949 P279 2Lower1 P281 DR
J_A1999 N245 N251 0 DR
R3235 VDD N245 50k
J_F813 VDD N245 P282 DR
R3236 P282 N255 1k
R3237 N255 VSS 4.5k
J_A2000 N263 2Upper2 P283 DR
R3238 VDD N263 100k
J_F814 VDD N263 P284 DR
R3239 P284 N269 1k
R3240 N269 VSS 4.8k
J_B950 P283 2Lower2 P285 DR
J_A2001 N265 N269 0 DR
R3241 VDD N265 50k
J_F815 VDD N265 P286 DR
R3242 P286 N274 1k
R3243 N274 VSS 4.5k
J_A2002 N285 2Upper2 P287 DR
R3244 VDD N285 100k
J_F816 VDD N285 P288 DR
R3245 P288 N291 1k
R3246 N291 VSS 4.8k
J_B951 P287 2Lower3 N297 DR
J_A2003 N287 N291 0 DR
R3247 VDD N287 50k
J_F817 VDD N287 P289 DR
R3248 P289 N294 1k
R3249 N294 VSS 4.5k
J_A2004 N309 2Upper3 P290 DR
R3250 VDD N309 100k
J_F818 VDD N309 P291 DR
R3251 P291 N318 1k
R3252 N318 VSS 4.8k
J_B952 P290 2Lower0 P292 DR
J_A2005 N313 N318 0 DR
R3253 VDD N313 50k
J_F819 VDD N313 P293 DR
R3254 P293 N322 1k
R3255 N322 VSS 4.5k
J_A2006 N315 2Upper3 P294 DR
R3256 VDD N315 100k
J_F820 VDD N315 P295 DR
R3257 P295 N323 1k
R3258 N323 VSS 4.8k
J_B953 P294 2Lower1 N325 DR
J_A2007 N320 N323 0 DR
R3259 VDD N320 50k
J_F821 VDD N320 P296 DR
R3260 P296 N324 1k
R3261 N324 VSS 4.5k
J_A2008 N235 N239 P297 DR
R3262 VDD N235 100k
J_F822 VDD N235 P298 DR
R3263 P298 N240 1k
R3264 N240 VSS 4.8k
J_B954 P297 ControlSignals 0 DR
J_A2009 N238 N240 0 DR
R3265 VDD N238 50k
J_F823 VDD N238 P299 DR
R3266 P299 CLB 1k
R3267 CLB VSS 4.5k
J_A2010 N223 2Upper1 P300 DR
R3268 VDD N223 100k
J_F824 VDD N223 P301 DR
R3269 P301 N233 1k
R3270 N233 VSS 4.8k
J_B955 P302 ControlSignals 0 DR
J_A2011 N227 N233 0 DR
R3271 VDD N227 50k
J_F825 VDD N227 P303 DR
R3272 P303 CMA 1k
R3273 CMA VSS 4.5k
J_A2012 N243 2Upper1 P304 DR
R3274 VDD N243 100k
J_F826 VDD N243 P305 DR
R3275 P305 N252 1k
R3276 N252 VSS 4.8k
J_B956 P306 ControlSignals 0 DR
J_A2013 N247 N252 0 DR
R3277 VDD N247 50k
J_F827 VDD N247 P307 DR
R3278 P307 RAL 1k
R3279 RAL VSS 4.5k
J_A2014 N267 2Upper1 P308 DR
R3280 VDD N267 100k
J_F828 VDD N267 P309 DR
R3281 P309 N278 1k
R3282 N278 VSS 4.8k
J_B957 P310 ControlSignals 0 DR
J_A2015 N273 N278 0 DR
R3283 VDD N273 50k
J_F829 VDD N273 P311 DR
R3284 P311 RAR 1k
R3285 RAR VSS 4.5k
J_A2016 N288 2Upper1 P312 DR
R3286 VDD N288 100k
J_F830 VDD N288 P313 DR
R3287 P313 N298 1k
R3288 N298 VSS 4.8k
J_B958 P314 ControlSignals 0 DR
J_A2017 N292 N298 0 DR
R3289 VDD N292 50k
J_F831 VDD N292 P315 DR
R3290 P315 TCC 1k
R3291 TCC VSS 4.5k
J_B959 P277 ControlSignals 0 DR
J_A2018 N241 2Upper2 P316 DR
R3292 VDD N241 100k
J_F832 VDD N241 P317 DR
R3293 P317 N248 1k
R3294 N248 VSS 4.8k
J_B960 P318 ControlSignals 0 DR
J_A2019 N244 N248 0 DR
R3295 VDD N244 50k
J_F833 VDD N244 P319 DR
R3296 P319 TCS 1k
R3297 TCS VSS 4.5k
J_A2020 N262 2Upper2 P320 DR
R3298 VDD N262 100k
J_F834 VDD N262 P321 DR
R3299 P321 N268 1k
R3300 N268 VSS 4.8k
J_B961 P322 ControlSignals 0 DR
J_A2021 N264 N268 0 DR
R3301 VDD N264 50k
J_F835 VDD N264 P323 DR
R3302 P323 STC 1k
R3303 STC VSS 4.5k
J_A2022 N284 2Upper2 P324 DR
R3304 VDD N284 100k
J_F836 VDD N284 P325 DR
R3305 P325 N289 1k
R3306 N289 VSS 4.8k
J_B962 P326 ControlSignals 0 DR
J_A2023 N286 N289 0 DR
R3307 VDD N286 50k
J_F837 VDD N286 P327 DR
R3308 P327 DAA 1k
R3309 DAA VSS 4.5k
J_A2024 N310 2Upper3 P328 DR
R3310 VDD N310 100k
J_F838 VDD N310 P329 DR
R3311 P329 N319 1k
R3312 N319 VSS 4.8k
J_B963 P330 ControlSignals 0 DR
J_A2025 N314 N319 0 DR
R3313 VDD N314 50k
J_F839 VDD N314 P331 DR
R3314 P331 KBP 1k
R3315 KBP VSS 4.5k
J_A2026 N312 2Upper3 P332 DR
R3316 VDD N312 100k
J_F840 VDD N312 P333 DR
R3317 P333 N321 1k
R3318 N321 VSS 4.8k
J_B964 P334 ControlSignals 0 DR
J_A2027 N316 N321 0 DR
R3319 VDD N316 50k
J_F841 VDD N316 P335 DR
R3320 P335 DCL 1k
R3321 DCL VSS 4.5k
J_A2028 N306 AZ 0 DR
J_A2029 N297 !TestPin 0 DR
R3322 VDD Jump 100k
J_F842 VDD Jump P336 DR
R3323 P336 N231 1k
R3324 N231 VSS 4.8k
J_A2030 N226 N231 0 DR
R3325 VDD N226 50k
J_A2031 VDD N226 P337 DR
R3326 P337 Jumping 1k
R3327 Jumping VSS 4.5k
J_A2032 Jump N239 0 DR
J_A2033 Jump N237 0 DR
J_A2034 Jump N259 0 DR
J_A2035 Jump N302 0 DR
J_A2036 Jump N255 0 DR
J_A2037 Jump N274 0 DR
J_A2038 Jump N294 0 DR
J_A2039 Jump N281 0 DR
J_A2040 N306 CF 0 DR
J_A2041 N306 TestPin 0 DR
J_A2042 N297 !CF 0 DR
J_A2043 N325 AN 0 DR
J_A2044 Jump N324 0 DR
J_A2045 N325 !TestPin 0 DR
J_A2046 N249 2Upper0 P338 DR
R3328 VDD N249 100k
J_F843 VDD N249 P339 DR
R3329 P339 N258 1k
R3330 N258 VSS 4.8k
J_B965 P338 2Lower1 P340 DR
J_A2047 N254 N258 0 DR
R3331 VDD N254 50k
J_F844 VDD N254 P341 DR
R3332 P341 CLC 1k
R3333 CLC VSS 4.5k
J_A2048 N253 TestPin P342 DR
R3334 VDD N253 100k
J_F845 VDD N253 P343 DR
R3335 P343 N260 1k
R3336 N260 VSS 4.8k
J_B966 P342 2Upper0 P344 DR
J_A2049 N257 N260 0 DR
R3337 VDD N257 50k
J_F846 VDD N257 P345 DR
R3338 P345 N261 1k
R3339 N261 VSS 4.5k
J_A2050 Jump N261 0 DR
J_B967 P344 2Lower1 0 DR
J_B968 P340 ControlSignals 0 DR
J_A2051 N271 2Upper0 P346 DR
R3340 VDD N271 100k
J_F847 VDD N271 P347 DR
R3341 P347 N280 1k
R3342 N280 VSS 4.8k
J_B969 P346 2Lower2 P348 DR
J_A2052 N276 N280 0 DR
R3343 VDD N276 50k
J_F848 VDD N276 P349 DR
R3344 P349 N283 1k
R3345 N283 VSS 4.5k
J_A2053 N270 2Upper0 P350 DR
R3346 VDD N270 100k
J_F849 VDD N270 P351 DR
R3347 P351 N279 1k
R3348 N279 VSS 4.8k
J_B970 P352 ControlSignals 0 DR
J_A2054 N275 N279 0 DR
R3349 VDD N275 50k
J_F850 VDD N275 P353 DR
R3350 P353 IAC 1k
R3351 IAC VSS 4.5k
J_A2055 Jump N283 0 DR
J_B971 P348 CF 0 DR
J_A2056 P350 2Lower2 P352 DR
J_A2057 N303 2Upper0 P354 DR
R3352 VDD N295 100k
J_F851 VDD N295 P355 DR
R3353 P355 N304 1k
R3354 N304 VSS 4.8k
J_B972 P354 2Lower3 0 DR
J_A2058 N300 N304 0 DR
R3355 VDD N300 50k
J_F852 VDD N300 P356 DR
R3356 P356 N307 1k
R3357 N307 VSS 4.5k
J_A2059 N296 2Upper0 P357 DR
R3358 VDD N296 100k
J_F853 VDD N296 P358 DR
R3359 P358 N305 1k
R3360 N305 VSS 4.8k
J_B973 P357 2Lower3 P359 DR
J_A2060 N301 N305 0 DR
R3361 VDD N301 50k
J_F854 VDD N301 P360 DR
R3362 P360 CMC 1k
R3363 CMC VSS 4.5k
J_A2061 Jump N307 0 DR
J_A2062 N295 TestPin N303 DR
J_B974 N295 CF N303 DR
J_B975 P359 ControlSignals 0 DR
J_A2063 P263 AZ 0 DR
J_B976 P300 2Lower0 P302 DR
J_A2064 P267 TestPin 0 DR
J_A2065 P304 2Lower1 P306 DR
J_B977 N282 CF 0 DR
J_B978 N282 AZ 0 DR
J_A2066 P308 2Lower2 P310 DR
J_A2067 P312 2Lower3 P314 DR
J_B979 P281 !TestPin 0 DR
J_A2068 P316 2Lower1 P318 DR
J_B980 P285 !CF 0 DR
J_A2069 P320 2Lower2 P322 DR
J_A2070 P324 2Lower3 P326 DR
J_B981 P292 AN 0 DR
J_A2071 Jump N322 0 DR
J_A2072 P328 2Lower0 P330 DR
J_A2073 P332 2Lower1 P334 DR
J_A2074 N167 Upper3 P361 DR
R3364 VDD N167 100k
J_F855 VDD N167 P362 DR
R3365 P362 N177 1k
R3366 N177 VSS 4.8k
J_B982 P361 Lower2 0 DR
J_A2075 N172 N177 0 DR
R3367 VDD N172 50k
J_F856 VDD N172 P363 DR
R3368 P363 RAMSignals 1k
R3369 RAMSignals VSS 4.5k
J_A2076 N182 2Upper2 P364 DR
R3370 VDD N182 100k
J_F857 VDD N182 P365 DR
R3371 P365 !SBM 1k
R3372 !SBM VSS 4.8k
J_B983 P364 2Lower0 P366 DR
J_A2077 N183 !SBM 0 DR
R3373 VDD N183 50k
J_F858 VDD N183 P367 DR
R3374 P367 SBM 1k
R3375 SBM VSS 4.5k
J_A2078 N197 2Upper2 P368 DR
R3376 VDD N197 100k
J_F859 VDD N197 P369 DR
R3377 P369 !ADM 1k
R3378 !ADM VSS 4.8k
J_B984 P368 2Lower3 P370 DR
J_A2079 N200 !ADM 0 DR
R3379 VDD N200 50k
J_F860 VDD N200 P371 DR
R3380 P371 ADM 1k
R3381 ADM VSS 4.5k
J_B985 P366 RAMSignals 0 DR
J_B986 P370 RAMSignals 0 DR
J_A2080 N124 ISZ 0 DR
R3382 VDD N124 100k
J_F861 VDD N124 P372 DR
R3383 P372 N134 1k
R3384 N134 VSS 4.8k
J_A2081 N124 JMS 0 DR
J_A2082 N124 JUN 0 DR
J_A2083 N124 FIM 0 DR
J_A2084 N124 JCN 0 DR
R3403 VDD N140 100k
J_F868 VDD N140 P373 DR
R3404 P373 !2Acc 1k
R3405 !2Acc VSS 4.8k
J_A2094 N145 !2Acc 0 DR
R3406 VDD N145 50k
J_F869 VDD N145 P374 DR
R3407 P374 2Acc 1k
R3408 2Acc VSS 4.5k
J_A2095 N140 A_Q1 N147 DR
J_A2096 N147 A_Q0 0 DR
J_A2097 N140 A_Q3 N147 DR
J_A2098 N147 A_Q2 0 DR
J_A2099 N109 RAMSignals P375 DR
R3409 VDD N109 100k
J_F870 VDD N109 P376 DR
R3410 P376 N117 1k
R3411 N117 VSS 4.8k
J_B989 P375 !IR2_3 0 DR
J_A2100 N112 N117 0 DR
R3412 VDD N112 50k
J_F871 VDD N112 P377 DR
R3413 P377 WR 1k
R3414 WR VSS 4.5k
J_A2101 N154 RAMSignals P378 DR
R3415 VDD N154 100k
J_F872 VDD N154 P379 DR
R3416 P379 N164 1k
R3417 N164 VSS 4.8k
J_B990 P380 IR2_3 0 DR
J_A2102 N159 N164 0 DR
R3418 VDD N159 50k
J_F873 VDD N159 P381 DR
R3419 P381 RD 1k
R3420 RD VSS 4.5k
J_B991 P382 !ADM P380 DR
J_B992 P378 !SBM P382 DR
J_A2647 N129 N134 0 DR
R4558 VDD N129 50k
J_F1201 VDD N129 P383 DR
R4559 P383 !2Word 1k
R4560 !2Word VSS 4.5k
.model NJF NJF
.model PJF PJF
.lib standard.jft
* Instruction Register 1
* Instruction Register 2
* Instruction Register 3
* Instruction Register 4
* Instruction Register
* IR1 MUX
* IR2 MUX
* JCN U
* CLB
* JCN AZ
* CMA
* JCN AZ | TN
* RAL
* RAR
* JCN AZ | CN
* JCN AZ | CN | TN
* TCC
* JCN TZ
* TCS
* JCN CZ
* STC
* DAC
* JCN CZ | TZ
* DAA
* JCN AN
* KBP
* JCN AN | TZ
* DCL
* JCN TN
* CLC
* JCN CN
* IAC
* JCN CN | TN
* CMC
* RAM Controls
.backanno
.end